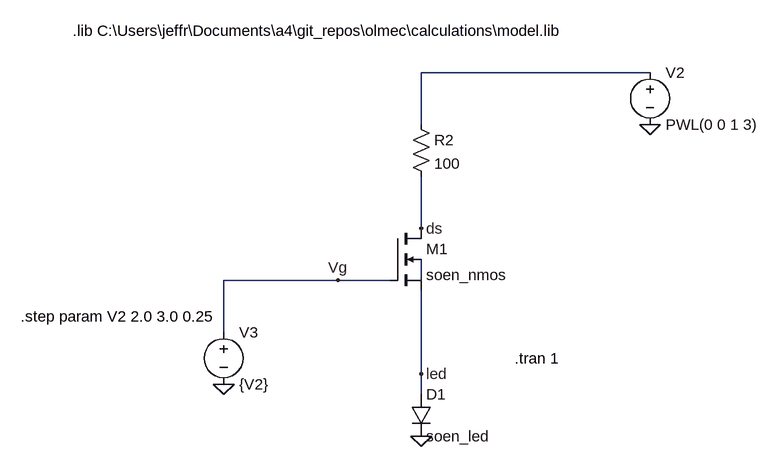
[diagram p0: schematic mosfet_led.asc]
mosfet_led.asc, the LTspice schematic file:
Version 4
SHEET 1 880 680
WIRE 80 -16 -272 -16
WIRE -272 64 -272 -16
WIRE -272 224 -272 144
WIRE -400 304 -576 304
WIRE -320 304 -400 304
WIRE -272 304 -272 272
WIRE -576 384 -576 304
WIRE -272 448 -272 320
WIRE -272 480 -272 448
FLAG 80 64 0
FLAG -576 464 0
FLAG -272 224 ds
FLAG -400 304 Vg
FLAG -272 544 0
FLAG -272 448 led
SYMBOL voltage 80 -32 R0
WINDOW 123 0 0 Left 0
WINDOW 39 0 0 Left 0
SYMATTR InstName V2
SYMATTR Value PWL(0 0 1 3)
SYMBOL voltage -576 368 R0
WINDOW 123 0 0 Left 0
WINDOW 39 0 0 Left 0
SYMATTR InstName V3
SYMATTR Value {V2}
SYMBOL res -288 48 R0
SYMATTR InstName R2
SYMATTR Value 100
SYMBOL nmos4 -320 224 R0
SYMATTR InstName M1
SYMATTR Value soen_nmos
SYMATTR Value2 l=1u w=20u
SYMBOL diode -288 480 R0
SYMATTR InstName D1
SYMATTR Value soen_led
TEXT -128 424 Left 2 !.tran 1
TEXT -808 -80 Left 2 !.lib C:\\Users\\jeffr\\Documents\\a4\\git_repos\\olmec\\calculations\\model.lib
TEXT -888 360 Left 2 !.step param V2 2.0 3.0 0.25

The netlist it stands for:
* mosfet_led.asc
V2 N001 0 PWL(0 0 1 3)
V3 Vg 0 {V2}
R2 N001 ds 100
M1 ds Vg led N002 soen_nmos l=1u w=20u
D1 led 0 soen_led
.model D D
.lib standard.dio
.model NMOS NMOS
.model PMOS PMOS
.lib standard.mos
.tran 1
.lib C:\Users\jeffr\Documents\a4\git_repos\olmec\calculations\model.lib
.step param V2 2.0 3.0 0.25
.backanno
.end

* Results of the author's LTspice run, read from the files saved beside the schematic
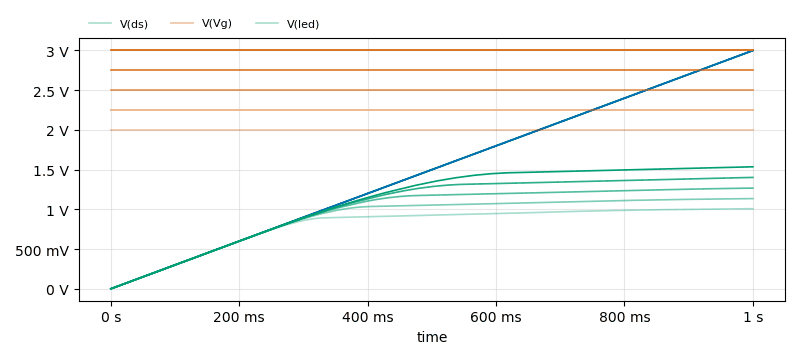
[diagram p1: Transient Analysis of mosfet_led.asc, plotted from the saved traces]
* Transient Analysis, 5 runs:
*   V(ds) [v2=2]: min 0 V, max 3 V, average 1.5 V, rms 1.734 V, last 3 V
*   V(ds) [v2=2.25]: min 0 V, max 2.999 V, average 1.5 V, rms 1.737 V, last 2.999 V
*   V(ds) [v2=2.5]: min 0 V, max 2.999 V, average 1.499 V, rms 1.737 V, last 2.999 V
*   V(ds) [v2=2.75]: min 0 V, max 2.998 V, average 1.499 V, rms 1.744 V, last 2.998 V
*   V(ds) [v2=3]: min 0 V, max 2.997 V, average 1.499 V, rms 1.751 V, last 2.997 V
*   V(Vg) [v2=2]: min 2 V, max 2 V, average 2 V, rms 2 V, last 2 V
*   V(Vg) [v2=2.25]: min 2.25 V, max 2.25 V, average 2.25 V, rms 2.25 V, last 2.25 V
*   V(Vg) [v2=2.5]: min 2.5 V, max 2.5 V, average 2.5 V, rms 2.5 V, last 2.5 V
*   V(Vg) [v2=2.75]: min 2.75 V, max 2.75 V, average 2.75 V, rms 2.75 V, last 2.75 V
*   V(Vg) [v2=3]: min 3 V, max 3 V, average 3 V, rms 3 V, last 3 V
*   V(led) [v2=2]: min 0 V, max 1.008 V, average 801.8 mV, rms 847.3 mV, last 1.008 V
*   V(led) [v2=2.25]: min 0 V, max 1.135 V, average 885.7 mV, rms 942.6 mV, last 1.135 V
*   V(led) [v2=2.5]: min 0 V, max 1.267 V, average 962.7 mV, rms 1.032 V, last 1.267 V
*   V(led) [v2=2.75]: min 0 V, max 1.401 V, average 1.034 V, rms 1.117 V, last 1.401 V
*   V(led) [v2=3]: min 0 V, max 1.535 V, average 1.101 V, rms 1.199 V, last 1.535 V